# EAGLE schematic SrcBackplaneSingleLayer00_01 (EAGLE 7.7.0)
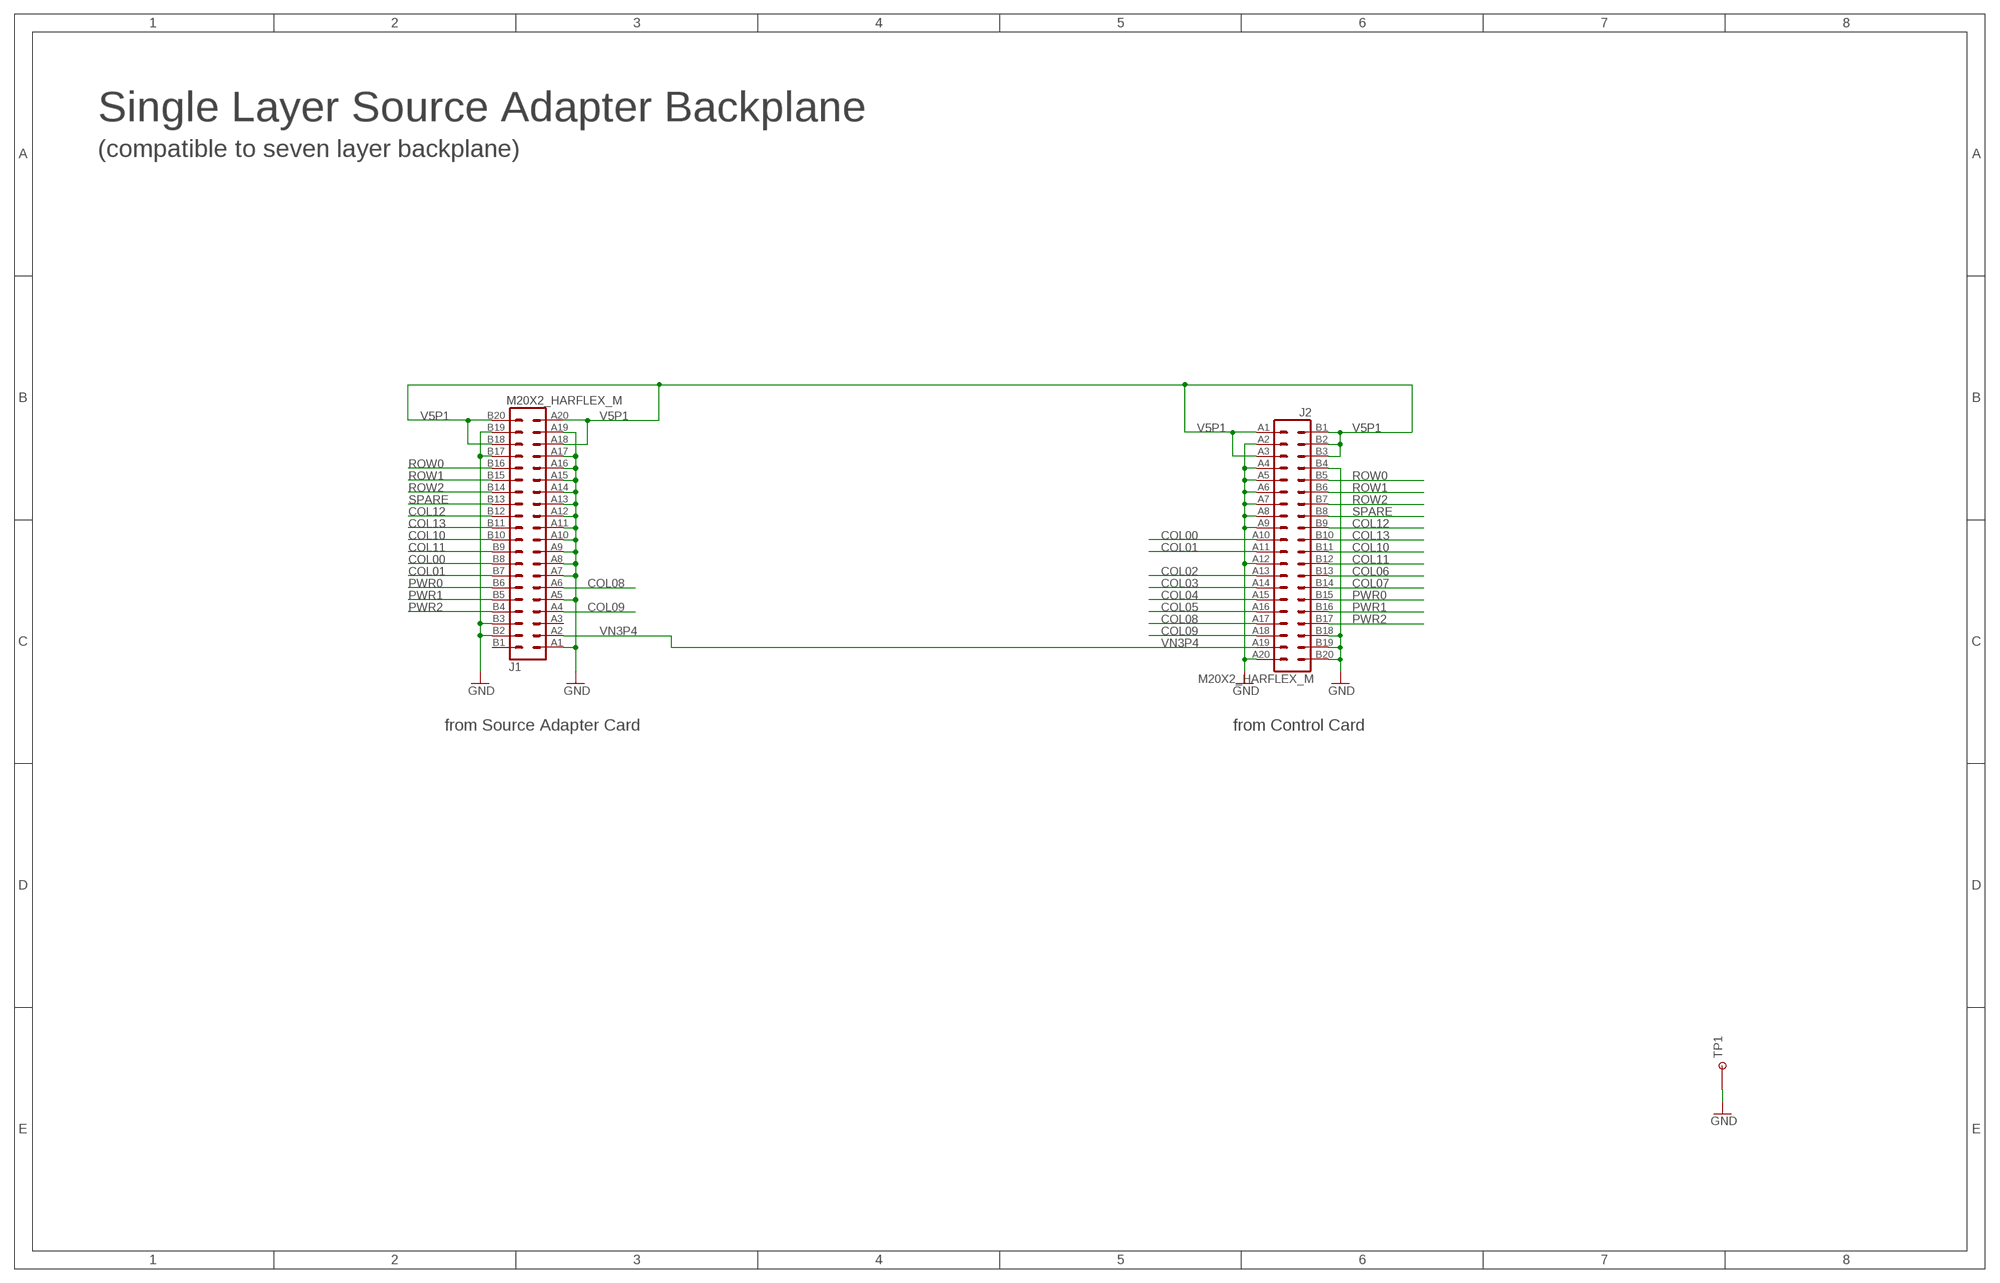
[diagram p0: schematic, sheet 1]

## Parts
J1  M20X2_HARFLEX_M  [M20X2_HARFLEX_M]
J2  M20X2_HARFLEX_M  [M20X2_HARFLEX_M]
TP1  TESTPOINT_ROUND  [TESTPAD_ROUND]

## Nets
COL00: J1.B8 J2.A10
COL01: J1.B7 J2.A11
COL02: J2.A13
COL03: J2.A14
COL04: J2.A15
COL05: J2.A16
COL06: J2.B13
COL07: J2.B14
COL08: J1.A6 J2.A17
COL09: J1.A4 J2.A18
COL10: J1.B10 J2.B11
COL11: J1.B9 J2.B12
COL12: J1.B12 J2.B9
COL13: J1.B11 J2.B10
GND: J1.A1 J1.A5 J1.A7 J1.A8 J1.A9 J1.A10 J1.A11 J1.A12 J1.A13 J1.A14 J1.A15 J1.A16 J1.A17 J1.A19 J1.B2 J1.B3 J1.B17 J1.B19 J2.A2 J2.A4 J2.A5 J2.A6 J2.A7 J2.A8 J2.A9 J2.A12 J2.A20 J2.B4 J2.B18 J2.B19 J2.B20 TP1.P$1
PWR0: J1.B6 J2.B15
PWR1: J1.B5 J2.B16
PWR2: J1.B4 J2.B17
ROW0: J1.B16 J2.B5
ROW1: J1.B15 J2.B6
ROW2: J1.B14 J2.B7
SPARE: J1.B13 J2.B8
V5P1: J1.A18 J1.A20 J1.B18 J1.B20 J2.A1 J2.A3 J2.B1 J2.B2 J2.B3
VN3P4: J1.A2 J2.A19
Unconnected: J1.A3 J1.B1

## Notes on the sheet
- Single Layer Source Adapter Backplane
- (compatible to seven layer backplane)
- from Source Adapter Card | from Control Card

## Library data of the parts
J1 J2 = MyLib:M20X2
TP1 = MyLib:TESTPOINT